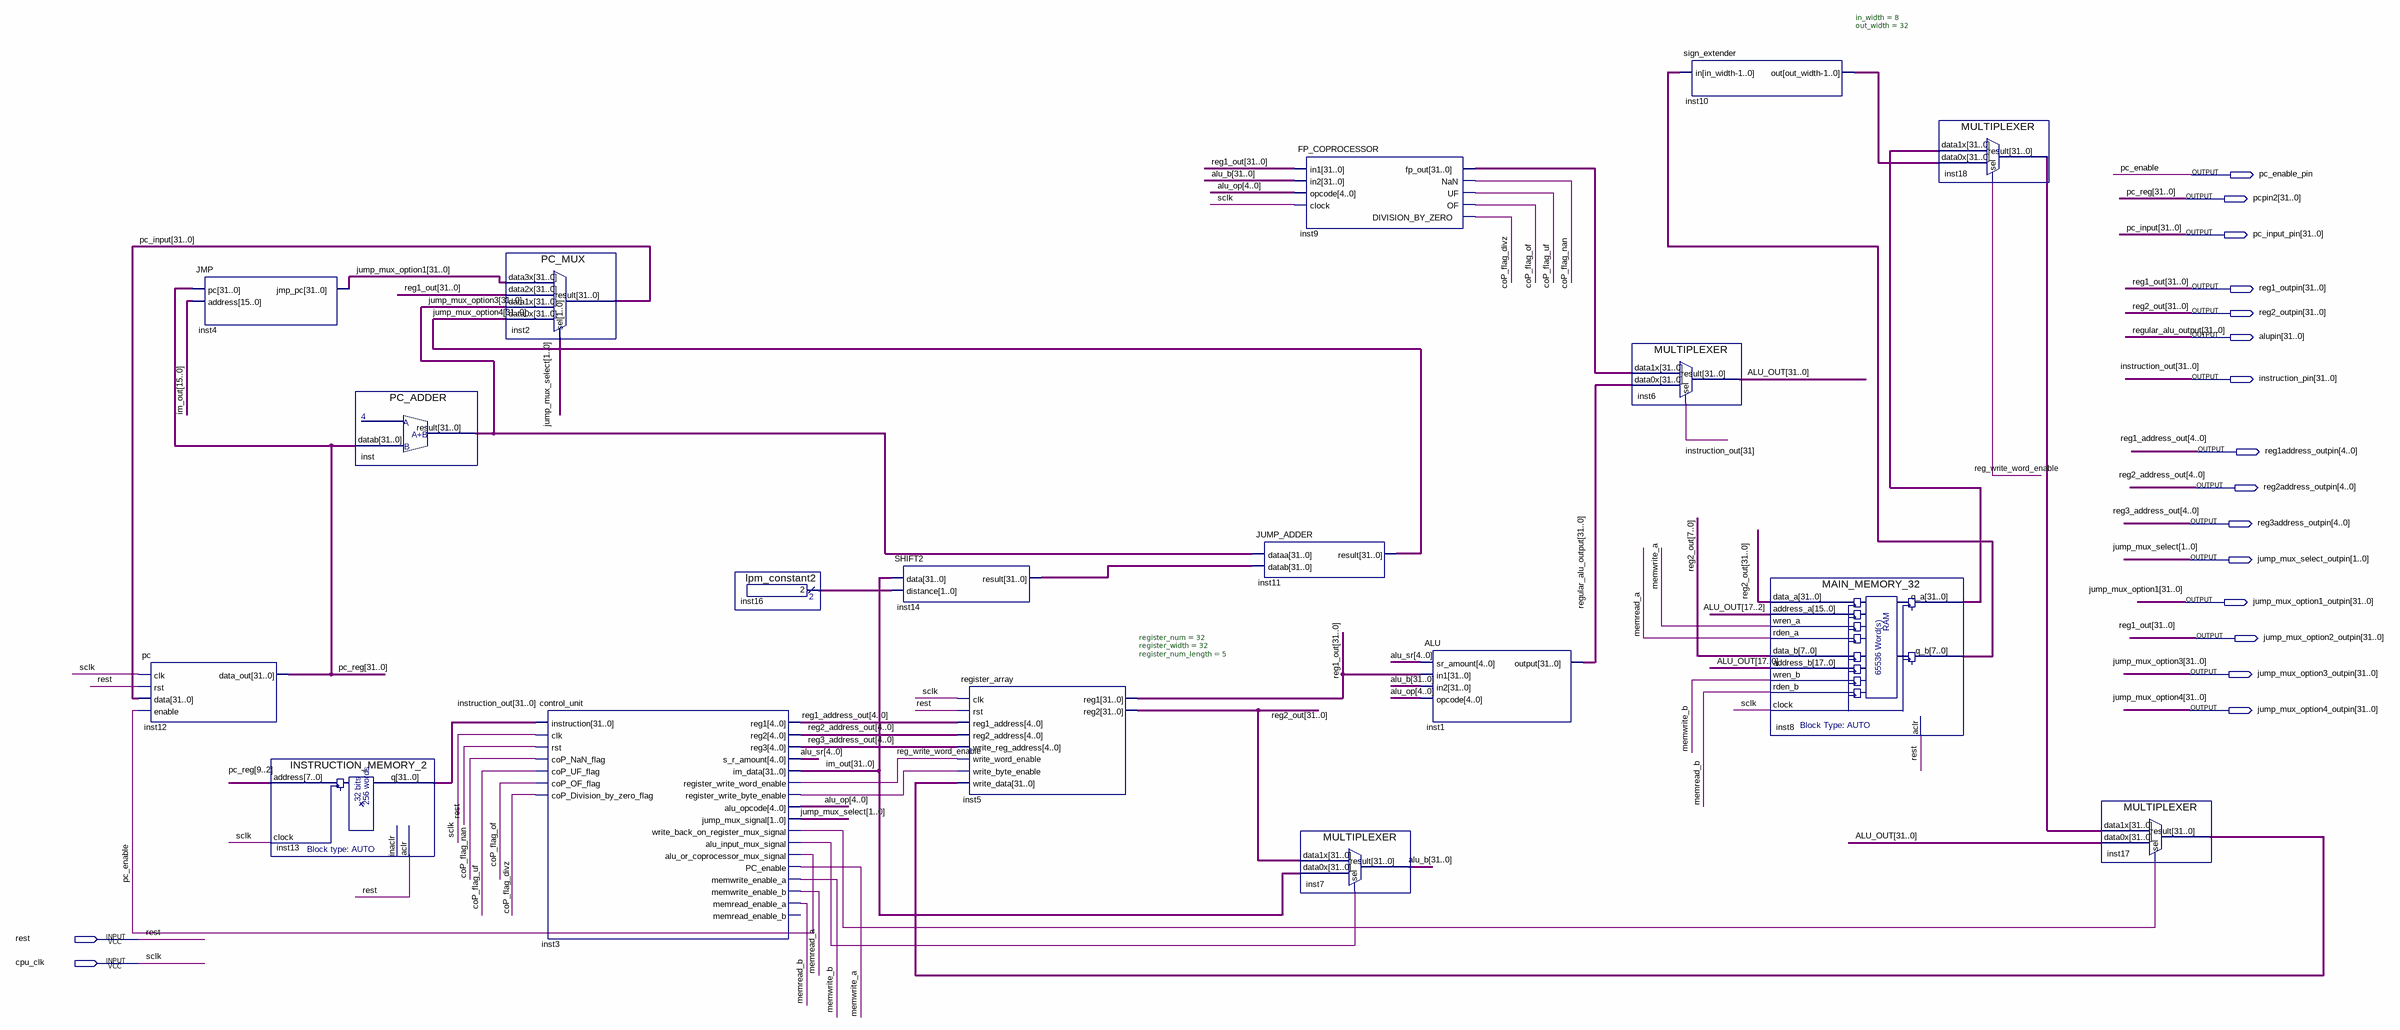
[diagram p0: schematic sheet]
// Quartus schematic CPUProject.bdf as structural Verilog: 18 symbols, 17 pins
module CPUProject (
  input  rest,
  input  cpu_clk,
  output pc_enable_pin,
  output [31:0] pcpin2,
  output [31:0] pc_input_pin,
  output [31:0] reg1_outpin,
  output [31:0] reg2_outpin,
  output [31:0] alupin,
  output [31:0] instruction_pin,
  output [4:0] reg1address_outpin,
  output [4:0] reg2address_outpin,
  output [4:0] reg3address_outpin,
  output [1:0] jump_mux_select_outpin,
  output [31:0] jump_mux_option1_outpin,
  output [31:0] jump_mux_option2_outpin,
  output [31:0] jump_mux_option3_outpin,
  output [31:0] jump_mux_option4_outpin
);

  wire coP_flag_divz, coP_flag_nan, coP_flag_of, coP_flag_uf, inst3_alu_input_mux_signal,
       inst3_register_write_byte_enable, inst3_write_back_on_register_mux_signal, memread_a, memread_b,
       memwrite_a, memwrite_b, reg_write_word_enable;
  wire [1:0] inst16_result;
  wire [4:0] alu_op, alu_sr;
  wire [7:0] inst8_q_b;
  wire [31:0] alu_b, ALU_OUT, im_out, inst8_q_a, inst9_fp_out, inst10_out, inst14_result, inst17_result,
       inst18_result;

  pc inst12 (.clk(cpu_clk), .rst(rest), .data(pc_input_pin), .enable(pc_enable_pin), .data_out(pcpin2));
  JMP inst4 (.pc(pcpin2), .address(im_out[15:0]), .jmp_pc(jump_mux_option1_outpin));
  INSTRUCTION_MEMORY_2 inst13 (
    .aclr(rest), .address(pcpin2[9:2]), .clock(cpu_clk), .q(instruction_pin));  // open: inaclr
  PC_ADDER inst (.datab(pcpin2), .result(jump_mux_option3_outpin));
  PC_MUX inst2 (
    .data3x(jump_mux_option1_outpin), .data2x(jump_mux_option2_outpin), .data1x(jump_mux_option3_outpin),
    .data0x(jump_mux_option4_outpin), .sel(jump_mux_select_outpin), .result(pc_input_pin));
  control_unit inst3 (
    .instruction(instruction_pin), .clk(cpu_clk), .rst(rest), .coP_NaN_flag(coP_flag_nan),
    .coP_UF_flag(coP_flag_uf), .coP_OF_flag(coP_flag_of), .coP_Division_by_zero_flag(coP_flag_divz),
    .reg1(reg1address_outpin), .reg2(reg2address_outpin), .reg3(reg3address_outpin), .s_r_amount(alu_sr),
    .im_data(im_out), .register_write_word_enable(reg_write_word_enable),
    .register_write_byte_enable(inst3_register_write_byte_enable), .alu_opcode(alu_op),
    .jump_mux_signal(jump_mux_select_outpin),
    .write_back_on_register_mux_signal(inst3_write_back_on_register_mux_signal),
    .alu_input_mux_signal(inst3_alu_input_mux_signal), .alu_or_coprocessor_mux_signal(pc_enable_pin),
    .PC_enable(memwrite_a), .memwrite_enable_a(memwrite_b), .memwrite_enable_b(memread_a),
    .memread_enable_a(memread_b));  // open: memread_enable_b
  lpm_constant2 inst16 (.result(inst16_result));
  SHIFT2 inst14 (.data(im_out), .distance(inst16_result), .result(inst14_result));
  register_array #(.register_num(32), .register_width(32), .register_num_length(5)) inst5 (
    .clk(cpu_clk), .rst(rest), .reg1_address(reg1address_outpin), .reg2_address(reg2address_outpin),
    .write_reg_address(reg3address_outpin), .write_word_enable(reg_write_word_enable),
    .write_byte_enable(inst3_register_write_byte_enable), .write_data(inst17_result),
    .reg1(jump_mux_option2_outpin), .reg2(reg2_outpin));
  JUMP_ADDER inst11 (.dataa(jump_mux_option3_outpin), .datab(inst14_result), .result(jump_mux_option4_outpin));
  FP_COPROCESSOR inst9 (
    .in1(jump_mux_option2_outpin), .in2(alu_b), .opcode(alu_op), .clock(cpu_clk), .fp_out(inst9_fp_out),
    .NaN(coP_flag_nan), .UF(coP_flag_uf), .OF(coP_flag_of), .DIVISION_BY_ZERO(coP_flag_divz));
  MULTIPLEXER inst7 (.data1x(reg2_outpin), .data0x(im_out), .sel(inst3_alu_input_mux_signal), .result(alu_b));
  ALU inst1 (.sr_amount(alu_sr), .in1(jump_mux_option2_outpin), .in2(alu_b), .opcode(alu_op), .\output (alupin));
  MULTIPLEXER inst6 (.data1x(inst9_fp_out), .data0x(alupin), .sel(instruction_pin[31]), .result(ALU_OUT));
  sign_extender #(.in_width(8), .out_width(32)) inst10 (.in(inst8_q_b), .out(inst10_out));
  MAIN_MEMORY_32 inst8 (
    .data_a(reg2_outpin), .address_a(ALU_OUT[17:2]), .wren_a(memwrite_a), .rden_a(memread_a),
    .data_b(reg2_outpin[7:0]), .address_b(ALU_OUT[17:0]), .wren_b(memwrite_b), .rden_b(memread_b),
    .clock(cpu_clk), .aclr(rest), .q_a(inst8_q_a), .q_b(inst8_q_b));
  MULTIPLEXER inst18 (.data1x(inst8_q_a), .data0x(inst10_out), .sel(reg_write_word_enable), .result(inst18_result));
  MULTIPLEXER inst17 (
    .data1x(inst18_result), .data0x(ALU_OUT), .sel(inst3_write_back_on_register_mux_signal),
    .result(inst17_result));

  assign reg1_outpin = jump_mux_option2_outpin;

  // Other names for the same wires on the sheet: instruction_out[31:0] = instruction_pin;
  //   jump_mux_option1[31:0] = jump_mux_option1_outpin; jump_mux_option3[31:0] = jump_mux_option3_outpin;
  //   jump_mux_option4[31:0] = jump_mux_option4_outpin; jump_mux_select[1:0] = jump_mux_select_outpin;
  //   pc_enable = pc_enable_pin; pc_input[31:0] = pc_input_pin; pc_reg[31:0] = pcpin2;
  //   reg1_address_out[4:0] = reg1address_outpin; reg1_out[31:0] = jump_mux_option2_outpin;
  //   reg2_address_out[4:0] = reg2address_outpin; reg2_out[31:0] = reg2_outpin;
  //   reg3_address_out[4:0] = reg3address_outpin; regular_alu_output[31:0] = alupin; sclk = cpu_clk
endmodule
